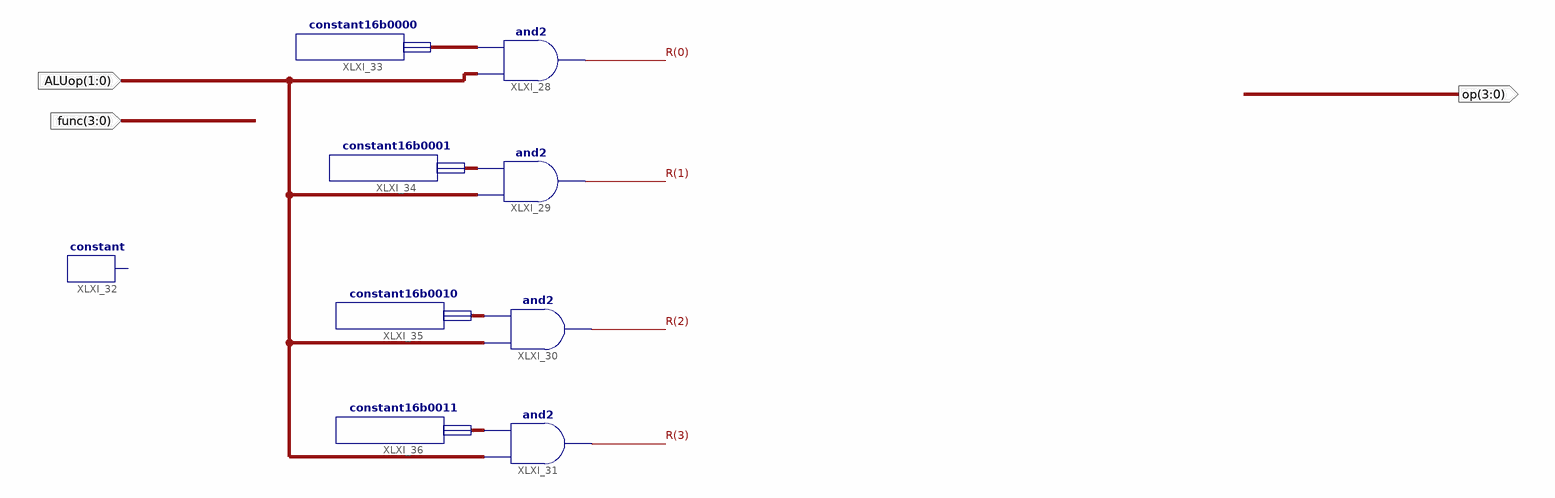
[diagram p0: schematic sheet 1]
// Xilinx ISE schematic aluControl.sch (spartan3e) as structural Verilog: 9 symbols, 3 ports
module aluControl (
  input  [3:0] func,
  input  [1:0] ALUop,
  output [3:0] op
);

  wire [3:0] R;
  wire [15:0] XLXN_4, XLXN_5, XLXN_6, XLXN_7;

  assign R[0] = ALUop & XLXN_4;  // and2 XLXI_28, 16 bits wide
  assign R[1] = ALUop & XLXN_5;  // and2 XLXI_29, 16 bits wide
  assign R[2] = ALUop & XLXN_6;  // and2 XLXI_30, 16 bits wide
  assign R[3] = ALUop & XLXN_7;  // and2 XLXI_31, 16 bits wide
  constant XLXI_32 ();  // open: O
  constant16b0000 XLXI_33 (.O(XLXN_4));
  constant16b0001 XLXI_34 (.O(XLXN_5));
  constant16b0010 XLXI_35 (.O(XLXN_6));
  constant16b0011 XLXI_36 (.O(XLXN_7));
endmodule
